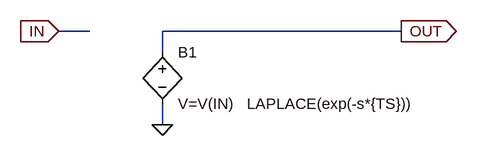
[diagram p0: schematic Laplace_sT.asc]
Laplace_sT.asc, the LTspice schematic file:
Version 4
SHEET 1 880 680
WIRE 144 224 96 224
WIRE 256 224 624 224
WIRE 256 224 256 256
WIRE 256 336 256 368
FLAG 256 368 0
FLAG 96 224 IN
IOPIN 96 224 In
FLAG 624 224 OUT
IOPIN 624 224 Out
SYMBOL bv 256 240 R0
SYMATTR InstName B1
SYMATTR Value V=V(IN)   LAPLACE(exp(-s*{TS}))

The netlist it stands for:
* Laplace_sT.asc
B1 OUT 0 V=V(IN)   LAPLACE(exp(-s*{TS}))
.backanno
.end